# EAGLE design Robot_Psoc (EAGLE 7.5.0)
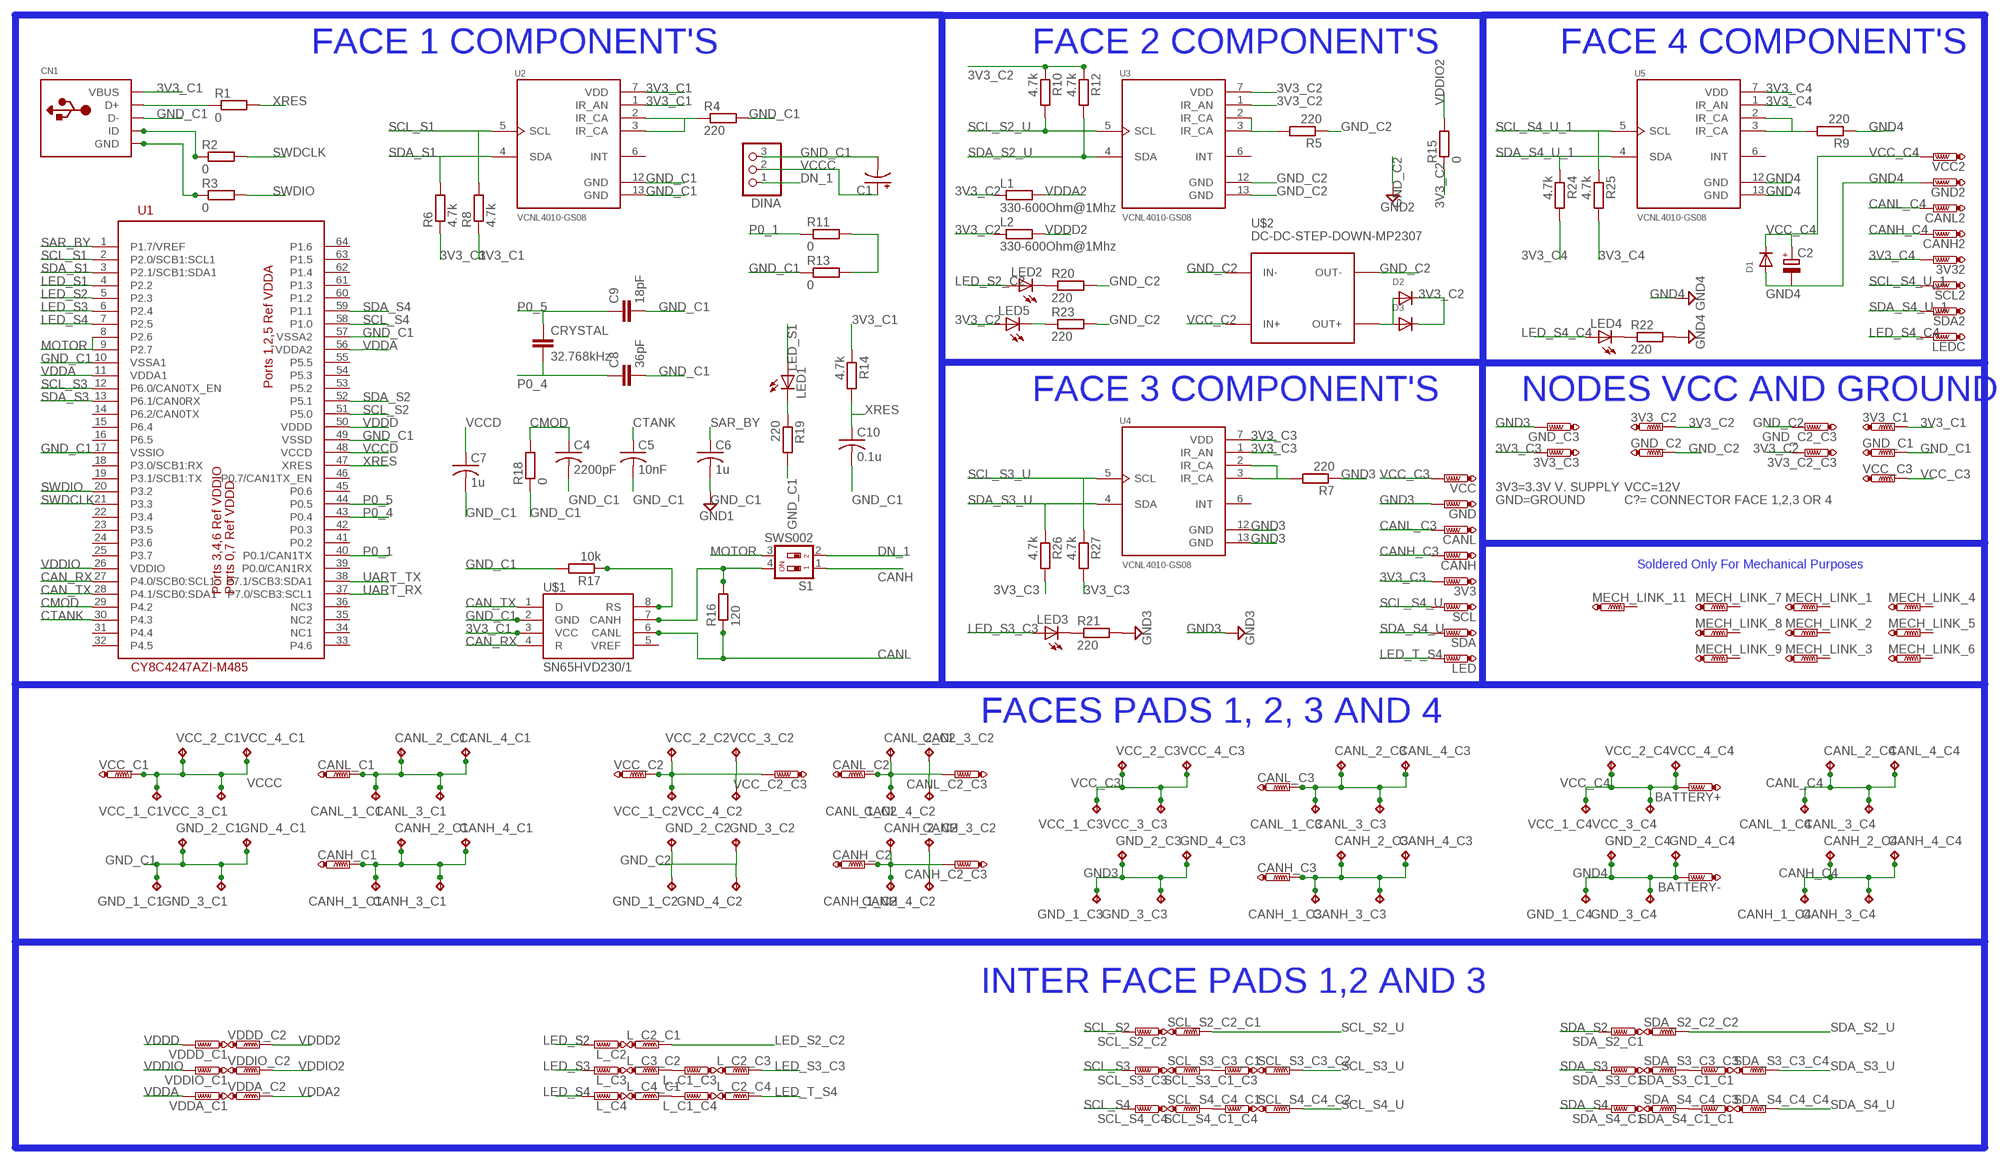
[diagram p0: schematic, sheet 1]

## Parts
3V3  PTR1TP11R  [TP11R]
3V3_C1  PTR1TP11R  [TP11R]
3V3_C2  PTR1TP11R  [TP11R]
3V3_C2_C3  PTR1TP11R  [TP11R]
3V3_C3  PTR1TP11R  [TP11R]
3V32  PTR1TP11R  [TP11R]
BATTERY+  PTR1TP11R  [TP11R]
BATTERY-  PTR1TP11R  [TP11R]
C1  CPOL-USUD-5X5,8  [UD-5X5,8_NICHICON]
C2  CPOL-EUUD-8X10  [UD-8X10_NICHICON]
C4  2200pF  C-USC0805  [C0805]
C5  10nF  C-USC0805  [C0805]
C6  1u  C-USC0805  [C0805]
C7  1u  C-USC0805  [C0805]
C8  36pF  C-EUC0805  [C0805]
C9  18pF  C-EUC0805  [C0805]
C10  0.1u  C-USC0805  [C0805]
CANH  PTR1TP11R  [TP11R]
CANH2  PTR1TP11R  [TP11R]
CANH_1_C1  TPB2,54  [B2,54]
CANH_1_C2  TPB2,54  [B2,54]
CANH_1_C3  TPB2,54  [B2,54]
CANH_1_C4  TPB2,54  [B2,54]
CANH_2_C1  TPB2,54  [B2,54]
CANH_2_C2  TPB2,54  [B2,54]
CANH_2_C3  TPB2,54  [B2,54]
CANH_2_C4  TPB2,54  [B2,54]
CANH_3_C1  TPB2,54  [B2,54]
CANH_3_C2  TPB2,54  [B2,54]
CANH_3_C3  TPB2,54  [B2,54]
CANH_3_C4  TPB2,54  [B2,54]
CANH_4_C1  TPB2,54  [B2,54]
CANH_4_C2  TPB2,54  [B2,54]
CANH_4_C3  TPB2,54  [B2,54]
CANH_4_C4  TPB2,54  [B2,54]
CANH_C1  PTR1TP11R  [TP11R]
CANH_C2  PTR1TP11R  [TP11R]
CANH_C2_C3  PTR1TP11R  [TP11R]
CANH_C3  PTR1TP11R  [TP11R]
CANL  PTR1TP11R  [TP11R]
CANL2  PTR1TP11R  [TP11R]
CANL_1_C1  TPB2,54  [B2,54]
CANL_1_C2  TPB2,54  [B2,54]
CANL_1_C3  TPB2,54  [B2,54]
CANL_1_C4  TPB2,54  [B2,54]
CANL_2_C1  TPB2,54  [B2,54]
CANL_2_C2  TPB2,54  [B2,54]
CANL_2_C3  TPB2,54  [B2,54]
CANL_2_C4  TPB2,54  [B2,54]
CANL_3_C1  TPB2,54  [B2,54]
CANL_3_C2  TPB2,54  [B2,54]
CANL_3_C3  TPB2,54  [B2,54]
CANL_3_C4  TPB2,54  [B2,54]
CANL_4_C1  TPB2,54  [B2,54]
CANL_4_C2  TPB2,54  [B2,54]
CANL_4_C3  TPB2,54  [B2,54]
CANL_4_C4  TPB2,54  [B2,54]
CANL_C1  PTR1TP11R  [TP11R]
CANL_C2  PTR1TP11R  [TP11R]
CANL_C2_C3  PTR1TP11R  [TP11R]
CANL_C3  PTR1TP11R  [TP11R]
CN1  USBMINIB  [USB-MINIB]
CRYSTAL  32.768kHz  C-EUC0603  [C0603]
D1  DIODESMA  [SMADIODE]
D2  DIODESOD-123  [SOD-123]
D3  DIODESOD-123  [SOD-123]
DINA  PINHD-1X3  [1X03]
GND  PTR1TP11R  [TP11R]
GND2  PTR1TP11R  [TP11R]
GND_1_C1  TPB2,54  [B2,54]
GND_1_C2  TPB2,54  [B2,54]
GND_1_C3  TPB2,54  [B2,54]
GND_1_C4  TPB2,54  [B2,54]
GND_2_C1  TPB2,54  [B2,54]
GND_2_C2  TPB2,54  [B2,54]
GND_2_C3  TPB2,54  [B2,54]
GND_2_C4  TPB2,54  [B2,54]
GND_3_C1  TPB2,54  [B2,54]
GND_3_C2  TPB2,54  [B2,54]
GND_3_C3  TPB2,54  [B2,54]
GND_3_C4  TPB2,54  [B2,54]
GND_4_C1  TPB2,54  [B2,54]
GND_4_C2  TPB2,54  [B2,54]
GND_4_C3  TPB2,54  [B2,54]
GND_4_C4  TPB2,54  [B2,54]
GND_C1  PTR1TP11R  [TP11R]
GND_C2  PTR1TP11R  [TP11R]
GND_C2_C3  PTR1TP11R  [TP11R]
GND_C3  PTR1TP11R  [TP11R]
L1  330-600Ohm@1Mhz  R-EU_R0805  [R0805]
L2  330-600Ohm@1Mhz  R-EU_R0805  [R0805]
L_C1_C3  PTR1TP11R  [TP11R]
L_C1_C4  PTR1TP11R  [TP11R]
L_C2  PTR1TP11R  [TP11R]
L_C2_C1  PTR1TP11R  [TP11R]
L_C2_C3  PTR1TP11R  [TP11R]
L_C2_C4  PTR1TP11R  [TP11R]
L_C3  PTR1TP11R  [TP11R]
L_C3_C2  PTR1TP11R  [TP11R]
L_C4  PTR1TP11R  [TP11R]
L_C4_C1  PTR1TP11R  [TP11R]
LED  PTR1TP11R  [TP11R]
LED1  LEDCHIPLED_0805  [CHIPLED_0805]
LED2  LEDCHIPLED_0805  [CHIPLED_0805]
LED3  LEDCHIPLED_0805  [CHIPLED_0805]
LED4  LEDCHIPLED_0805  [CHIPLED_0805]
LED5  LEDCHIPLED_0805  [CHIPLED_0805]
LEDC  PTR1TP11R  [TP11R]
MECH_LINK_1  PTR1TP11R  [TP11R]
MECH_LINK_2  PTR1TP11R  [TP11R]
MECH_LINK_3  PTR1TP11R  [TP11R]
MECH_LINK_4  PTR1TP11R  [TP11R]
MECH_LINK_5  PTR1TP11R  [TP11R]
MECH_LINK_6  PTR1TP11R  [TP11R]
MECH_LINK_7  PTR1TP11R  [TP11R]
MECH_LINK_8  PTR1TP11R  [TP11R]
MECH_LINK_9  PTR1TP11R  [TP11R]
MECH_LINK_11  PTR1TP11R  [TP11R]
R1  0  R-EU_R0805  [R0805]
R2  0  R-EU_R0805  [R0805]
R3  0  R-EU_R0805  [R0805]
R4  220  R-EU_R0805  [R0805]
R5  220  R-EU_R0805  [R0805]
R6  4.7k  R-EU_R0805  [R0805]
R7  220  R-EU_R0805  [R0805]
R8  4.7k  R-EU_R0805  [R0805]
R9  220  R-EU_R0805  [R0805]
R10  4.7k  R-EU_R0805  [R0805]
R11  0  R-EU_R0805  [R0805]
R12  4.7k  R-EU_R0805  [R0805]
R13  0  R-EU_R0805  [R0805]
R14  4.7k  R-EU_R0805  [R0805]
R15  0  R-EU_R0805  [R0805]
R16  120  R-EU_R0805  [R0805]
R17  10k  R-EU_R0805  [R0805]
R18  0  R-EU_R0805  [R0805]
R19  220  R-EU_R0805  [R0805]
R20  220  R-EU_R0805  [R0805]
R21  220  R-EU_R0805  [R0805]
R22  220  R-EU_R0805  [R0805]
R23  220  R-EU_R0805  [R0805]
R24  4.7k  R-EU_R0805  [R0805]
R25  4.7k  R-EU_R0805  [R0805]
R26  4.7k  R-EU_R0805  [R0805]
R27  4.7k  R-EU_R0805  [R0805]
S1  SWS002  [SMS-002]
SCL  PTR1TP11R  [TP11R]
SCL2  PTR1TP11R  [TP11R]
SCL_S2_C2  PTR1TP11R  [TP11R]
SCL_S2_C2_C1  PTR1TP11R  [TP11R]
SCL_S3_C1_C3  PTR1TP11R  [TP11R]
SCL_S3_C3  PTR1TP11R  [TP11R]
SCL_S3_C3_C1  PTR1TP11R  [TP11R]
SCL_S3_C3_C2  PTR1TP11R  [TP11R]
SCL_S4_C1_C4  PTR1TP11R  [TP11R]
SCL_S4_C4  PTR1TP11R  [TP11R]
SCL_S4_C4_C1  PTR1TP11R  [TP11R]
SCL_S4_C4_C2  PTR1TP11R  [TP11R]
SDA  PTR1TP11R  [TP11R]
SDA2  PTR1TP11R  [TP11R]
SDA_S2_C1  PTR1TP11R  [TP11R]
SDA_S2_C2_C2  PTR1TP11R  [TP11R]
SDA_S3_C1  PTR1TP11R  [TP11R]
SDA_S3_C1_C1  PTR1TP11R  [TP11R]
SDA_S3_C3_C3  PTR1TP11R  [TP11R]
SDA_S3_C3_C4  PTR1TP11R  [TP11R]
SDA_S4_C1  PTR1TP11R  [TP11R]
SDA_S4_C1_C1  PTR1TP11R  [TP11R]
SDA_S4_C4_C3  PTR1TP11R  [TP11R]
SDA_S4_C4_C4  PTR1TP11R  [TP11R]
U1  CY8C4247AZI-M485  [TQFP64-10X10]
U2  VCNL4010-GS08  [XDCR_VCNL4010-GS08]
U3  VCNL4010-GS08  [XDCR_VCNL4010-GS08]
U4  VCNL4010-GS08  [XDCR_VCNL4010-GS08]
U5  VCNL4010-GS08  [XDCR_VCNL4010-GS08]
U$1  SN65HVD230/1  [SO8]
U$2  DC-DC-STEP-DOWN-MP2307  [DC-DC-STEP-DOWN-MP2307]
VCC  PTR1TP11R  [TP11R]
VCC2  PTR1TP11R  [TP11R]
VCC_1_C1  TPB2,54  [B2,54]
VCC_1_C2  TPB2,54  [B2,54]
VCC_1_C3  TPB2,54  [B2,54]
VCC_1_C4  TPB2,54  [B2,54]
VCC_2_C1  TPB2,54  [B2,54]
VCC_2_C2  TPB2,54  [B2,54]
VCC_2_C3  TPB2,54  [B2,54]
VCC_2_C4  TPB2,54  [B2,54]
VCC_3_C1  TPB2,54  [B2,54]
VCC_3_C2  TPB2,54  [B2,54]
VCC_3_C3  TPB2,54  [B2,54]
VCC_3_C4  TPB2,54  [B2,54]
VCC_4_C1  TPB2,54  [B2,54]
VCC_4_C2  TPB2,54  [B2,54]
VCC_4_C3  TPB2,54  [B2,54]
VCC_4_C4  TPB2,54  [B2,54]
VCC_C1  PTR1TP11R  [TP11R]
VCC_C2  PTR1TP11R  [TP11R]
VCC_C2_C3  PTR1TP11R  [TP11R]
VCC_C3  PTR1TP11R  [TP11R]
VDDA_C1  PTR1TP11R  [TP11R]
VDDA_C2  PTR1TP11R  [TP11R]
VDDD_C1  PTR1TP11R  [TP11R]
VDDD_C2  PTR1TP11R  [TP11R]
VDDIO_C1  PTR1TP11R  [TP11R]
VDDIO_C2  PTR1TP11R  [TP11R]

## Nets
3V3_C1: 3V3_C1.TP CN1.VBUS R6.1 R8.1 R14.1 U2.1(IR_AN) U2.7(VDD) U$1.3(VCC)
3V3_C2: 3V3_C2.TP 3V3_C2_C3.TP D2.C D3.C L1.1 L2.1 LED5.A R10.1 R12.1 R15.1 U3.1(IR_AN) U3.7(VDD)
3V3_C3: 3V3.TP 3V3_C3.TP R26.2 R27.2 U4.1(IR_AN) U4.7(VDD)
3V3_C4: 3V32.TP R24.2 R25.2 U5.1(IR_AN) U5.7(VDD)
CAN_RX: U1.27(P4.0/SCB0:SCL1) U$1.4(R)
CAN_TX: U1.28(P4.1/SCB0:SDA1) U$1.1(D)
CANH: CANH_1_C1.TP CANH_2_C1.TP CANH_3_C1.TP CANH_4_C1.TP CANH_C1.TP S1.1
CANH_C3: CANH.TP CANH_1_C3.TP CANH_2_C3.TP CANH_3_C3.TP CANH_4_C3.TP CANH_C3.TP
CANH_C4: CANH2.TP CANH_1_C4.TP CANH_2_C4.TP CANH_3_C4.TP CANH_4_C4.TP
CANL: CANL_1_C1.TP CANL_2_C1.TP CANL_3_C1.TP CANL_4_C1.TP CANL_C1.TP R16.1 U$1.6(CANL)
CANL_C3: CANL.TP CANL_1_C3.TP CANL_2_C3.TP CANL_3_C3.TP CANL_4_C3.TP CANL_C3.TP
CANL_C4: CANL2.TP CANL_1_C4.TP CANL_2_C4.TP CANL_3_C4.TP CANL_4_C4.TP
CMOD: C4.1 R18.2 U1.29(P4.2)
CTANK: C5.1 U1.30(P4.3)
DN_1: DINA.1 S1.2
GND3: GND.TP GND_1_C3.TP GND_2_C3.TP GND_3_C3.TP GND_4_C3.TP GND_C3.TP R7.1 R21.2 U4.12(GND) U4.13(GND)
GND4: BATTERY-.TP C2.- D1.A GND2.TP GND_1_C4.TP GND_2_C4.TP GND_3_C4.TP GND_4_C4.TP R9.1 R22.2 U5.12(GND) U5.13(GND)
GND_C1: C1.- C4.2 C5.2 C6.2 C7.2 C8.2 C9.2 C10.2 CN1.D- DINA.3 GND_1_C1.TP GND_2_C1.TP GND_3_C1.TP GND_4_C1.TP GND_C1.TP R4.2 R13.1 R17.2 R18.1 R19.2 U1.10(VSSA1) U1.17(VSSIO) U1.49(VSSD) U1.57(VSSA2) U2.12(GND) U2.13(GND) U$1.2(GND) ; supply symbol labelled GND1
GND_C2: GND_1_C2.TP GND_2_C2.TP GND_3_C2.TP GND_4_C2.TP GND_C2.TP GND_C2_C3.TP R5.1 R20.2 R23.2 U3.12(GND) U3.13(GND) U$2.IN- U$2.OUT- ; supply symbol labelled GND2
LED_S1: LED1.A U1.4(P2.2)
LED_S2: L_C2.TP U1.5(P2.3)
LED_S2_C2: L_C2_C1.TP LED2.A
LED_S3: L_C3.TP U1.6(P2.4)
LED_S3_C3: L_C2_C3.TP LED3.A
LED_S4: L_C4.TP U1.7(P2.5)
LED_S4_C4: LED4.A LEDC.TP
LED_T_S4: L_C2_C4.TP LED.TP
MOTOR: S1.3 U1.8(P2.6) U1.9(P2.7)
N$1: CN1.D+ R1.1
N$2: CN1.ID R2.1
N$3: CN1.GND R3.1
N$4: R11.2 R13.2
N$5: R16.2 S1.4 U$1.7(CANH)
N$7: CANH_1_C2.TP CANH_2_C2.TP CANH_3_C2.TP CANH_4_C2.TP CANH_C2.TP CANH_C2_C3.TP
N$8: R7.2 U4.2(IR_CA) U4.3(IR_CA)
N$9: R17.1 U$1.8(RS)
N$10: SDA_S3_C1_C1.TP SDA_S3_C3_C3.TP
N$14: LED1.C R19.1
N$15: LED2.C R20.1
N$16: LED3.C R21.1
N$17: LED4.C R22.1
N$18: LED5.C R23.1
N$20: L_C1_C4.TP L_C4_C1.TP
N$21: R4.1 U2.2(IR_CA) U2.3(IR_CA)
N$22: L_C1_C3.TP L_C3_C2.TP
N$24: D2.A D3.A U$2.OUT+
N$26: SCL_S3_C1_C3.TP SCL_S3_C3_C1.TP
N$27: SCL_S4_C1_C4.TP SCL_S4_C4_C1.TP
N$32: CANL_1_C2.TP CANL_2_C2.TP CANL_3_C2.TP CANL_4_C2.TP CANL_C2.TP CANL_C2_C3.TP
N$43: R5.2 U3.2(IR_CA) U3.3(IR_CA)
N$44: SDA_S4_C1_C1.TP SDA_S4_C4_C3.TP
N$46: R9.2 U5.2(IR_CA) U5.3(IR_CA)
P0_1: R11.1 U1.40(P0.1/CAN1TX)
P0_4: C8.1 CRYSTAL.2 U1.43(P0.4)
P0_5: C9.1 CRYSTAL.1 U1.44(P0.5)
SAR_BY: C6.1 U1.1(P1.7/VREF)
SCL_S1: R8.2 U1.2(P2.0/SCB1:SCL1) U2.5(SCL)
SCL_S2: SCL_S2_C2.TP U1.51(P5.0)
SCL_S2_U: R10.2 SCL_S2_C2_C1.TP U3.5(SCL)
SCL_S3: SCL_S3_C3.TP U1.12(P6.0/CAN0TX_EN)
SCL_S3_U: R27.1 SCL_S3_C3_C2.TP U4.5(SCL)
SCL_S4: SCL_S4_C4.TP U1.58(P1.0)
SCL_S4_U: SCL.TP SCL_S4_C4_C2.TP
SCL_S4_U_1: R25.1 SCL2.TP U5.5(SCL)
SDA_S1: R6.2 U1.3(P2.1/SCB1:SDA1) U2.4(SDA)
SDA_S2: SDA_S2_C1.TP U1.52(P5.1)
SDA_S2_U: R12.2 SDA_S2_C2_C2.TP U3.4(SDA)
SDA_S3: SDA_S3_C1.TP U1.13(P6.1/CAN0RX)
SDA_S3_U: R26.1 SDA_S3_C3_C4.TP U4.4(SDA)
SDA_S4: SDA_S4_C1.TP U1.59(P1.1)
SDA_S4_U: SDA.TP SDA_S4_C4_C4.TP
SDA_S4_U_1: R24.1 SDA2.TP U5.4(SDA)
SWDCLK: R2.2 U1.21(P3.3)
SWDIO: R3.2 U1.20(P3.2)
UART_RX: U1.37(P7.0/SCB3:SCL1)
UART_TX: U1.38(P7.1/SCB3:SDA1)
VCC_C2: U$2.IN+ VCC_1_C2.TP VCC_2_C2.TP VCC_3_C2.TP VCC_4_C2.TP VCC_C2.TP VCC_C2_C3.TP
VCC_C3: VCC.TP VCC_1_C3.TP VCC_2_C3.TP VCC_3_C3.TP VCC_4_C3.TP VCC_C3.TP
VCC_C4: BATTERY+.TP C2.+ D1.C VCC2.TP VCC_1_C4.TP VCC_2_C4.TP VCC_3_C4.TP VCC_4_C4.TP
VCCC: C1.+ DINA.2 VCC_1_C1.TP VCC_2_C1.TP VCC_3_C1.TP VCC_4_C1.TP VCC_C1.TP
VCCD: C7.1 U1.48(VCCD)
VDDA: U1.11(VDDA1) U1.56(VDDA2) VDDA_C1.TP
VDDA2: L1.2 VDDA_C2.TP
VDDD: U1.50(VDDD) VDDD_C1.TP
VDDD2: L2.2 VDDD_C2.TP
VDDIO: U1.26(VDDIO) VDDIO_C1.TP
VDDIO2: R15.2 VDDIO_C2.TP
XRES: C10.1 R1.2 R14.2 U1.47(XRES)
Unconnected: MECH_LINK_1.TP MECH_LINK_2.TP MECH_LINK_3.TP MECH_LINK_4.TP MECH_LINK_5.TP MECH_LINK_6.TP MECH_LINK_7.TP MECH_LINK_8.TP MECH_LINK_9.TP MECH_LINK_11.TP U1.14(P6.2/CAN0TX) U1.15(P6.4) U1.16(P6.5) U1.18(P3.0/SCB1:RX) U1.19(P3.1/SCB1:TX) U1.22(P3.4) U1.23(P3.5) U1.24(P3.6) U1.25(P3.7) U1.31(P4.4) U1.32(P4.5) U1.33(P4.6) U1.34(NC1) U1.35(NC2) U1.36(NC3) U1.39(P0.0/CAN1RX) U1.41(P0.2) U1.42(P0.3) U1.45(P0.6) U1.46(P0.7/CAN1TX_EN) U1.53(P5.2) U1.54(P5.3) U1.55(P5.5) U1.60(P1.2) U1.61(P1.3) U1.62(P1.4) U1.63(P1.5) U1.64(P1.6) U2.6(INT) U3.6(INT) U4.6(INT) U5.6(INT) U$1.5(VREF)

## Notes on the sheet
- FACE 1 COMPONENT'S | FACE 2 COMPONENT'S | FACE 4 COMPONENT'S
- FACE 3 COMPONENT'S | NODES VCC AND GROUND
- 3V3=3.3V V. SUPPLY | VCC=12V
- GND=GROUND | C?= CONNECTOR FACE 1,2,3 OR 4
- Soldered Only For Mechanical Purposes
- FACES PADS 1, 2, 3 AND 4
- INTER FACE PADS 1,2 AND 3

## Library data of the parts
3V3 3V3_C1 3V3_C2 3V3_C2_C3 3V3_C3 3V32 BATTERY+ BATTERY- CANH CANH2 CANH_C1 CANH_C2 CANH_C2_C3 CANH_C3 CANL CANL2 CANL_C1 CANL_C2 CANL_C2_C3 CANL_C3 GND GND2 GND_C1 GND_C2 GND_C2_C3 GND_C3 L_C1_C3 L_C1_C4 L_C2 L_C2_C1 L_C2_C3 L_C2_C4 L_C3 L_C3_C2 L_C4 L_C4_C1 LED LEDC MECH_LINK_1-MECH_LINK_9 MECH_LINK_11 SCL SCL2 SCL_S2_C2 SCL_S2_C2_C1 SCL_S3_C1_C3 SCL_S3_C3 SCL_S3_C3_C1 SCL_S3_C3_C2 SCL_S4_C1_C4 SCL_S4_C4 SCL_S4_C4_C1 SCL_S4_C4_C2 SDA SDA2 SDA_S2_C1 SDA_S2_C2_C2 SDA_S3_C1 SDA_S3_C1_C1 SDA_S3_C3_C3 SDA_S3_C3_C4 SDA_S4_C1 SDA_S4_C1_C1 SDA_S4_C4_C3 SDA_S4_C4_C4 VCC VCC2 VCC_C1 VCC_C2 VCC_C2_C3 VCC_C3 VDDA_C1 VDDA_C2 VDDD_C1 VDDD_C2 VDDIO_C1 VDDIO_C2 = testpad:PTR1: TEST PIN
C1 = rcl:CPOL-US: POLARIZED CAPACITOR, American symbol
C2 = rcl:CPOL-EU: POLARIZED CAPACITOR, European symbol
C4-C7 C10 = rcl:C-US: CAPACITOR, American symbol
C8 C9 CRYSTAL = rcl:C-EU: CAPACITOR, European symbol
CANH_1_C1-CANH_1_C4 CANH_2_C1-CANH_2_C4 CANH_3_C1-CANH_3_C4 CANH_4_C1-CANH_4_C4 CANL_1_C1-CANL_1_C4 CANL_2_C1-CANL_2_C4 CANL_3_C1-CANL_3_C4 CANL_4_C1-CANL_4_C4 GND_1_C1-GND_1_C4 GND_2_C1-GND_2_C4 GND_3_C1-GND_3_C4 GND_4_C1-GND_4_C4 VCC_1_C1-VCC_1_C4 VCC_2_C1-VCC_2_C4 VCC_3_C1-VCC_3_C4 VCC_4_C1-VCC_4_C4 = testpad:TP: Test pad
CN1 = adafruit:USB: USB Connectors USBMINIB - Surface Mount Female Mini-B USB Connector 4UConnector: 06564 By microbuilder.eu Thru-hole RA Female Mini-B USB Connector 4UConnector: 18732 By ladyada.net
D1-D3 = adafruit:DIODE: Diode SMADIODE - SMA Surface Mount Package 20V 1A Schottky Diode Digikey: 641-1014-6-ND DO-1N4148 - Through Hole Small Current Diode SOD-123 20V 1 A (.5mV Vf) Schottky Diode - Digikey: MBRX120TPMSCT-ND SOD-323 10V 570mA (.38mV Vf, 3ns) Schottky Diode - Digikey: ZLLS410CT-ND SOD-523 30V 30mA Schottky Diode (RB751S-40TE61) - Digikey: RB751S-40TE61CT-ND SOT23-R/W - SOT23 Package (R = Solder Paste/Reflow Ovens, W = Hand-Soldering) BAT54Film 40V 300mA - Digikey: 497-7162-1-ND
DINA = pinhead:PINHD-1X3: PIN HEADER
L1 L2 R1-R27 = rcl:R-EU_: RESISTOR, European symbol
LED1-LED5 = adafruit:LED: LED OSRAM: - CHIPLED LG R971, LG N971, LY N971, LG Q971, LY Q971, LO R971, LY R971 LH N974, LH R974 LS Q976, LO Q976, LY Q976 LO Q996 - Hyper CHIPLED LW Q18S LB Q993, LB Q99A, LB R99A - SideLED LS A670, LO A670, LY A670, LG A670, LP A670 LB A673, LV A673, LT A673, LW A673 LH A674 LY A675 LS A676, LA A676, LO A676, LY A676, LW A676 LS A679, LY A679, LG A679 - Hyper Micro SIDELED® LS Y876, LA Y876, LO Y876, LY Y876 LT Y87S - SmartLED LW L88C, LW L88S LB L89C, LB L89S, LG L890 LS L89K, LO L89K, LY L89K LS L896, LA L896, LO L896, LY L896 - TOPLED LS T670, LO T670, LY T670, LG T670, LP T670 LSG T670, LSP T670, LSY T670, LOP T670, LYG T670 LG T671, LOG T671, LSG T671 LB T673, LV T673, LT T673, LW T673 LH T674 LS T676, LA T676, LO T676, LY T676, LB T676, LH T676, LSB T676, LW T676 LB T67C, LV T67C, LT T67C, LS T67K, LO T67K, LY T67K, LW E67C LS E67B, LA E67B, LO E67B, LY E67B, LB E67C, LV E67C, LT E67C LW T67C LS T679, LY T679, LG T679 LS T770, LO T770, LY T770, LG T770, LP T770 LB T773, LV T773, LT T773, LW T773 LH T774 LS E675, LA E675, LY E675, LS T675 LS T776, LA T776, LO T776, LY T776, LB T776 LHGB T686 LT T68C, LB T68C - Hyper Mini TOPLED® LB M676 - Mini TOPLED Santana® LG M470 LS M47K, LO M47K, LY M47K Source: http://www.osram.convergy.de/
S1 = smd-special:SWS002: SMD Dip Switch 2 pol.
U1 = CypressPSoC:CY8C4247AZI-M485
U2-U5 = VCNL4010-GS08:VCNL4010-GS08
U$1 = texas_instruments:SN65HVD230/1
U$2 = diy-modules:DC-DC-STEP-DOWN-MP2307: DC/DC Step-Down Regulator based on MP2307DN chip MP2307 datasheet available here: https://cdn-shop.adafruit.com/datasheets/MP2307_r1.9.pdf Click here to find device on ebay.com <http://www.ebay.com/sch/dc+dc+3a+mini+converter>

## Board
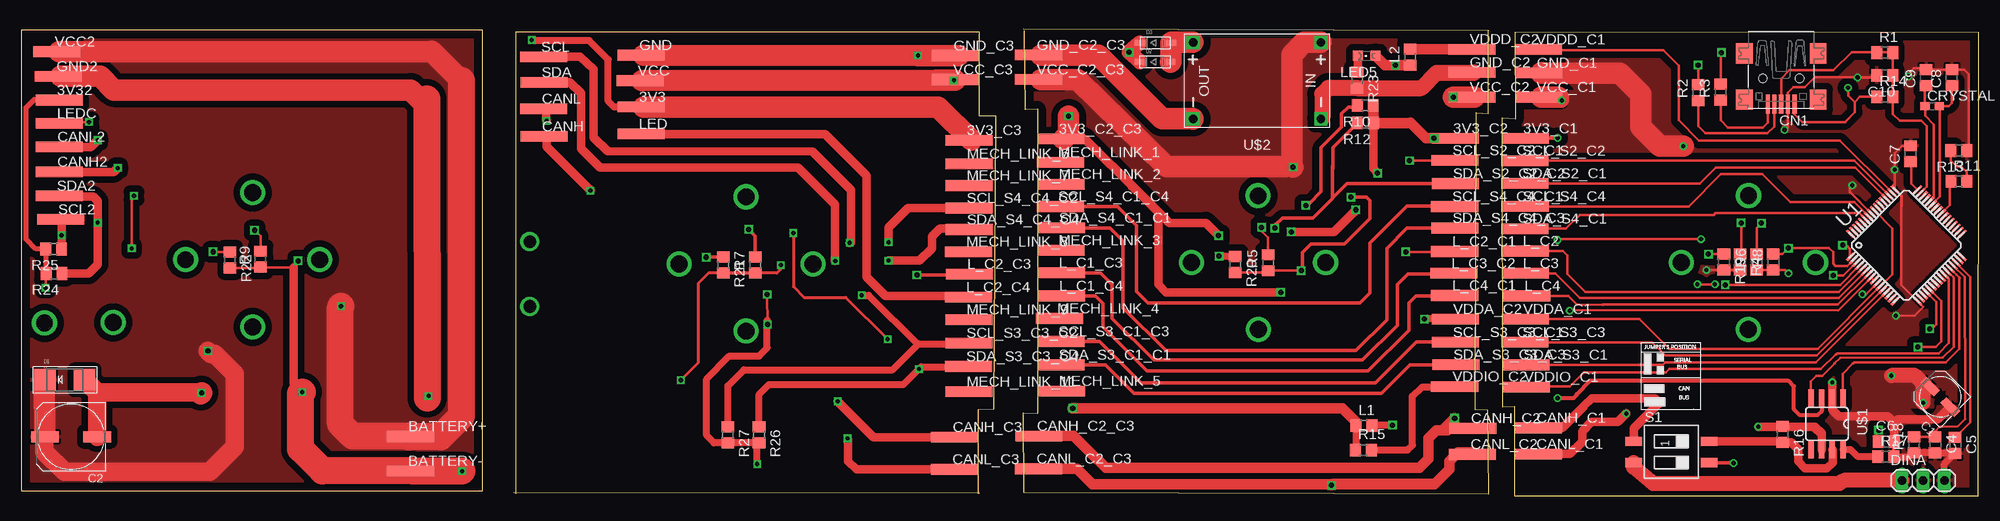
[diagram p1: board, top side]
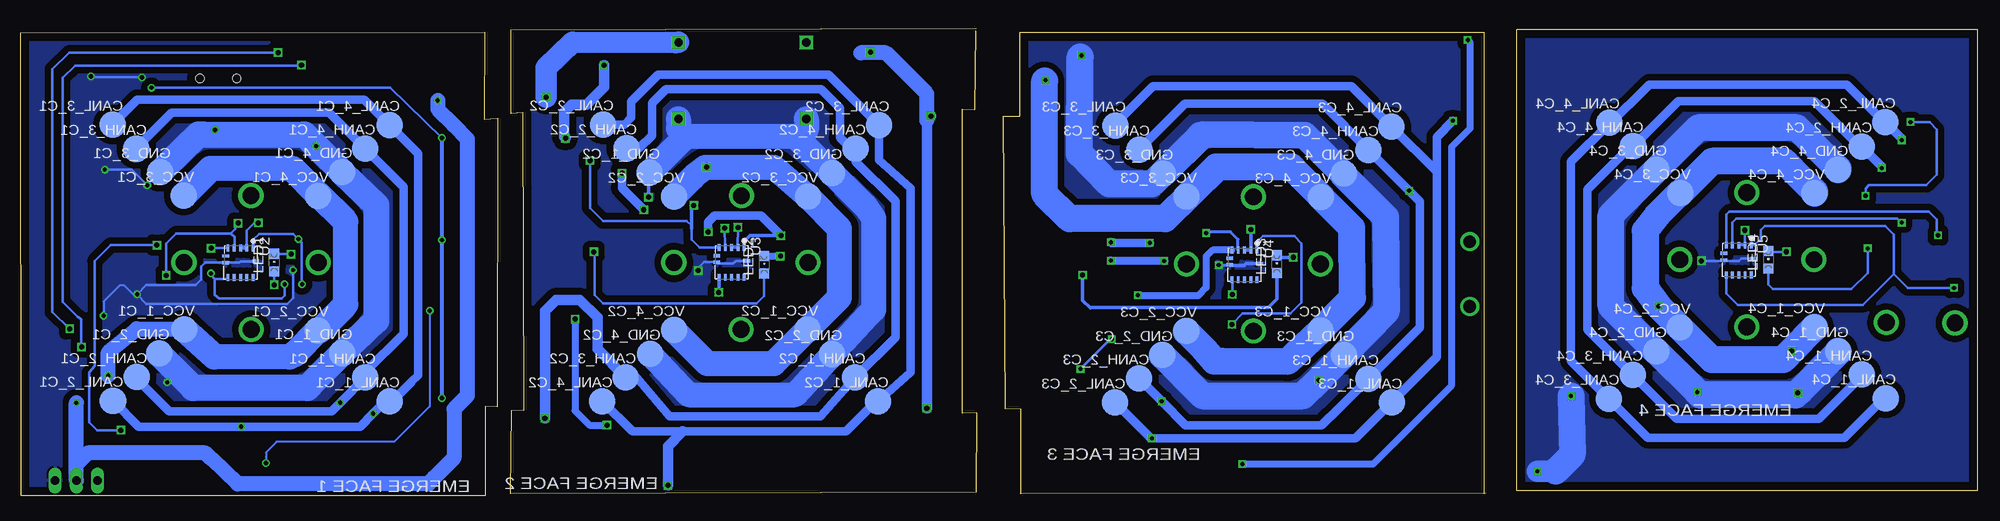
[diagram p2: board, bottom side, seen from below]

Size 233.41 x 55.75 mm. Coordinates in mm from the lower left corner, seen from the top.
Outline: 119.48,55.75 174.99,55.59
Outline: 114.12,0.25 114.14,10.35 115.97,10.37 116.21,45.31 114.24,45.31 114.28,55.35 58.9,55.37 58.93,0.28
Outline: 174.92,55.5 174.92,45.64 173.52,45.74 173.41,10.25 174.91,10.22 175.02,0.23 119.52,0.44 119.41,9.91 121.15,9.83 121.15,46.16 119.67,46.11 119.57,55.55
Outline: 114.28,0.31 58.7,0.36
Outline: 178.16,44.97 176.57,45.07 176.62,10.62 178.06,10.67 178.06,0 233.36,0.04 233.41,55.29 178.09,55.35 178.16,44.97
Outline: 0,0.62 55,0.62 55,55.62 0,55.62 0,0.62
Copper layers (1*16): Top 0.035mm / dielectric 1.5mm / Bottom 0.035mm
Design rules "default": minimum track width 10mil, minimum drill 24mil, track to track 8mil, track to pad 8mil, pad to pad 8mil, via to via 8mil, smd to smd 8mil, copper to edge 40mil, drill to drill 8mil, minimum pad ring 10mil, minimum via ring 8mil, stop-mask expansion 4mil, vias tented up to drill 0mil, thermal gap 10mil

### Footprints (pad centres in the part's own frame; a part is rotated, then mirrored left to right if it is on the bottom)
TP11R = smd 0.635 x 1.27: P$1 0.381,0; P$2 1.016,0; P$3 -0.254,0; P$4 -0.889,0; P$5 -1.524,0; P$6 1.613,0; P$7 2.21,0; P$8 -2.146,0; P$9 -2.769,0 | smd 1.1 x 1.1: TP 0,0
UD-5X5,8_NICHICON = smd 2.3 x 1: + 1.725,0; - -1.7,0
UD-8X10_NICHICON = smd 3.3 x 1.3: + 3.125,0; - -3.125,0
C0805 = smd 1.3 x 1.5: 1 -0.95,0; 2 0.95,0
B2,54 = smd 3.175 x 3.175 bottom: P$1 0,0 | smd 2.54 x 2.54 bottom: TP 0,0
USB-MINIB = smd 0.5 x 2.308: D+ 0,4.064; D- -0.8,4.064; GND 1.6,4.064; ID 0.8,4.064; VBUS -1.6,4.064 | smd 2 x 2.4: GND1 -4.4,-2; GND2 -4.4,3.5; GND3 4.4,3.5; GND4 4.4,-2 | hole 1: -2.2,1; 2.2,1
C0603 = smd 1.1 x 1: 1 -0.85,0; 2 0.85,0
SMADIODE = smd 2.54 x 2.54: A 2.349,0; C -2.349,0
SOD-123 = smd 1.2 x 0.7: A 1.85,0; C -1.85,0
1X03 = drill 1.016 long: 1 -2.54,0; 2 0,0; 3 2.54,0
R0805 = smd 1.3 x 1.5: 1 -0.95,0; 2 0.95,0
CHIPLED_0805 = smd 1.2 x 1.2: A 0,-1.05; C 0,1.05
SMS-002 = smd 1.092 x 2.007: 1 -1.27,-4.496; 2 1.27,-4.496; 3 1.27,4.496; 4 -1.27,4.496
TQFP64-10X10 = smd 1.2 x 0.3: 1 -5.7,3.75; 2 -5.7,3.25; 3 -5.7,2.75; 4 -5.7,2.25; 5 -5.7,1.75; 6 -5.7,1.25; 7 -5.7,0.75; 8 -5.7,0.25; 9 -5.7,-0.25; 10 -5.7,-0.75; 11 -5.7,-1.25; 12 -5.7,-1.75; 13 -5.7,-2.25; 14 -5.7,-2.75; 15 -5.7,-3.25; 16 -5.7,-3.75; 33 5.7,-3.75; 34 5.7,-3.25; 35 5.7,-2.75; 36 5.7,-2.25; 37 5.7,-1.75; 38 5.7,-1.25; 39 5.7,-0.75; 40 5.7,-0.25; 41 5.7,0.25; 42 5.7,0.75; 43 5.7,1.25; 44 5.7,1.75; 45 5.7,2.25; 46 5.7,2.75; 47 5.7,3.25; 48 5.7,3.75 | smd 0.3 x 1.2: 17 -3.75,-5.7; 18 -3.25,-5.7; 19 -2.75,-5.7; 20 -2.25,-5.7; 21 -1.75,-5.7; 22 -1.25,-5.7; 23 -0.75,-5.7; 24 -0.25,-5.7; 25 0.25,-5.7; 26 0.75,-5.7; 27 1.25,-5.7; 28 1.75,-5.7; 29 2.25,-5.7; 30 2.75,-5.7; 31 3.25,-5.7; 32 3.75,-5.7; 49 3.75,5.7; 50 3.25,5.7; 51 2.75,5.7; 52 2.25,5.7; 53 1.75,5.7; 54 1.25,5.7; 55 0.75,5.7; 56 0.25,5.7; 57 -0.25,5.7; 58 -0.75,5.7; 59 -1.25,5.7; 60 -1.75,5.7; 61 -2.25,5.7; 62 -2.75,5.7; 63 -3.25,5.7; 64 -3.75,5.7
XDCR_VCNL4010-GS08 = smd 0.805 x 0.35: 1 -1.772,1.5; 2 -1.772,0.75; 3 -1.772,0; 4 -1.772,-0.75; 5 -1.772,-1.5; 7 1.772,-1.5; 8 1.772,-0.75; 9 1.772,0; 10 1.772,0.75; 11 1.772,1.5 | smd 0.4 x 0.805: 6 -0.8,-1.772; 12 -0.175,1.772; 13 0,-1.772
SO8 = smd 0.66 x 2.032: 1 -1.905,-3.073; 2 -0.635,-3.073; 3 0.635,-3.073; 4 1.905,-3.073; 5 1.905,3.073; 6 0.635,3.073; 7 -0.635,3.073; 8 -1.905,3.073
DC-DC-STEP-DOWN-MP2307 = drill 1 pad 1.6 square: IN+ -7.62,-4.572; IN- -7.62,4.572; OUT+ 7.62,-4.572; OUT- 7.62,4.572

### Placement (x,y rotation side)
3V3  74.19,46.43 0 top
3V3_C1  179.63,42.67 0 top
3V3_C2  171.28,42.67 0 top
3V3_C2_C3  124.26,42.61 0 top
3V3_C3  113.28,42.46 0 top
3V32  4.75,47.24 0 top
BATTERY+  46.68,7.11 0 top
BATTERY-  46.67,2.98 0 top
C1  228.83,11.83 135 top
C2  5.9,7.06 180 top
C4  228.23,6.09 270 top
C5  230.61,6.04 270 top
C6  222.38,6.5 0 top
C7  225.31,40.84 90 top
C8  230.23,49.9 90 top
C9  227.16,49.9 90 top
C10  222.21,50.18 180 top
CANH  62.59,42.9 0 top
CANH2  4.78,38.68 0 top
CANH_1_C1  192.34,14.13 0 top
CANH_1_C2  133.91,14.16 0 top
CANH_1_C3  72.7,13.95 0 top
CANH_1_C4  13.85,14.49 0 top
CANH_2_C1  219.59,14.18 0 top
CANH_2_C2  161.18,41.49 0 top
CANH_2_C3  100.07,14.02 0 top
CANH_2_C4  13.85,41.71 0 top
CANH_3_C1  219.65,41.43 0 top
CANH_3_C2  161.27,14.16 0 top
CANH_3_C3  100,41.33 0 top
CANH_3_C4  41.18,14.46 0 top
CANH_4_C1  192.38,41.47 0 top
CANH_4_C2  133.86,41.46 0 top
CANH_4_C3  72.7,41.28 0 top
CANH_4_C4  41.13,41.75 0 top
CANH_C1  181.19,8.12 0 top
CANH_C2  173.39,8.07 0 top
CANH_C2_C3  121.62,7.16 0 top
CANH_C3  111.57,7.02 0 top
CANL  62.56,46.21 0 top
CANL2  4.79,41.66 0 top
CANL_1_C1  189.46,11.29 0 top
CANL_1_C2  131.16,11.3 0 top
CANL_1_C3  69.9,11.15 0 top
CANL_1_C4  11.01,11.65 0 top
CANL_2_C1  222.43,11.36 0 top
CANL_2_C2  163.95,44.34 0 top
CANL_2_C3  102.93,11.15 0 top
CANL_2_C4  11.05,44.62 0 top
CANL_3_C1  222.48,44.3 0 top
CANL_3_C2  131.06,44.24 0 top
CANL_3_C3  102.87,44.2 0 top
CANL_3_C4  44,11.59 0 top
CANL_4_C1  189.45,44.28 0 top
CANL_4_C2  164.08,11.3 0 top
CANL_4_C3  69.93,44.1 0 top
CANL_4_C4  43.96,44.58 0 top
CANL_C1  181.19,5 0 top
CANL_C2  173.34,4.97 0 top
CANL_C2_C3  121.57,3.24 0 top
CANL_C3  111.53,3.17 0 top
CN1  209.86,50.82 180 top
CRYSTAL  227.87,46.53 0 top
D1  5.15,13.87 0 top
D2  135.18,51.79 0 top
D3  135.21,54.07 0 top
DINA  226.8,1.85 0 top
GND  74.19,52.6 0 top
GND2  4.67,50.08 0 top
GND_1_C1  195.11,17.04 0 top
GND_1_C2  158.43,38.58 0 top
GND_1_C3  75.62,16.82 0 top
GND_1_C4  16.67,17.28 0 top
GND_2_C1  216.93,17.04 0 top
GND_2_C2  136.69,16.92 0 top
GND_2_C3  97.27,16.82 0 top
GND_2_C4  38.36,17.28 0 top
GND_3_C1  216.78,38.66 0 top
GND_3_C2  136.7,38.55 0 top
GND_3_C3  97.21,38.47 0 top
GND_3_C4  38.33,38.96 0 top
GND_4_C1  195.11,38.67 0 top
GND_4_C2  158.35,16.97 0 top
GND_4_C3  75.62,38.47 0 top
GND_4_C4  16.7,38.92 0 top
GND_C1  181.24,50.49 0 top
GND_C2  173.24,50.54 0 top
GND_C2_C3  121.6,52.62 0 top
GND_C3  111.67,52.54 0 top
L1  160.1,8.38 0 top
L2  165.62,52.37 90 top
L_C1_C3  124.29,26.64 0 top
L_C1_C4  124.31,23.87 0 top
L_C2  179.61,29.23 0 top
L_C2_C1  171.2,29.18 0 top
L_C2_C3  113.36,26.48 0 top
L_C2_C4  113.23,23.71 0 top
L_C3  179.63,26.56 0 top
L_C3_C2  171.1,26.56 0 top
L_C4  179.81,23.87 0 top
L_C4_C1  171.2,23.92 0 top
LED  74.19,43.2 0 top
LED1  203.21,27.86 0 bottom
LED2  144.76,27.6 0 bottom
LED3  83.62,27.67 0 bottom
LED4  24.99,28.18 0 bottom
LED5  160.43,52.52 90 top
LEDC  4.79,44.46 0 top
MECH_LINK_1  124.19,39.82 0 top
MECH_LINK_2  124.26,37.2 0 top
MECH_LINK_3  124.24,29.31 0 top
MECH_LINK_4  124.09,21.18 0 top
MECH_LINK_5  124.29,12.52 0 top
MECH_LINK_6  113.31,39.64 0 top
MECH_LINK_7  113.28,37.05 0 top
MECH_LINK_8  113.23,29.15 0 top
MECH_LINK_9  113.26,21.05 0 top
MECH_LINK_11  113.26,12.43 0 top
R1  222.21,52.9 0 top
R2  199.98,48.15 90 top
R3  202.65,48.18 90 top
R4  204.96,27.91 270 top
R5  148.67,27.83 90 top
R6  206.94,27.91 90 top
R7  87.5,27.57 90 top
R8  208.92,27.91 90 top
R9  28.5,28.25 90 top
R10  160.25,46.6 180 top
R11  231.07,37.53 0 top
R12  160.28,44.52 180 top
R13  231.05,41.22 180 top
R14  222.23,47.64 0 top
R15  160.05,5.49 0 top
R16  210.05,7.35 270 top
R17  222.36,4.69 0 top
R18  225.71,6.11 90 top
R19  203.03,27.91 270 top
R20  144.76,27.6 270 top
R21  83.69,27.55 270 top
R22  24.86,28.18 270 top
R23  159.29,49.64 270 top
R24  3.87,26.55 180 top
R25  3.81,29.47 180 top
R26  87.96,7.28 270 top
R27  84.24,7.28 270 top
S1  196.77,5.25 270 top
SCL  62.53,52.4 0 top
SCL2  4.93,33 0 top
SCL_S2_C2  179.56,40 0 top
SCL_S2_C2_C1  171.23,40.05 0 top
SCL_S3_C1_C3  124.24,18.43 0 top
SCL_S3_C3  179.58,18.33 0 top
SCL_S3_C3_C1  171.28,18.33 0 top
SCL_S3_C3_C2  113.26,18.25 0 top
SCL_S4_C1_C4  124.19,34.54 0 top
SCL_S4_C4  179.61,34.56 0 top
SCL_S4_C4_C1  171.2,34.54 0 top
SCL_S4_C4_C2  113.28,34.35 0 top
SDA  62.59,49.36 0 top
SDA2  4.78,35.82 0 top
SDA_S2_C1  179.56,37.31 0 top
SDA_S2_C2_C2  171.28,37.28 0 top
SDA_S3_C1  179.71,15.64 0 top
SDA_S3_C1_C1  124.26,15.64 0 top
SDA_S3_C3_C3  171.33,15.67 0 top
SDA_S3_C3_C4  113.23,15.46 0 top
SDA_S4_C1  179.6,31.9 0 top
SDA_S4_C1_C1  124.29,32 0 top
SDA_S4_C4_C3  171.23,31.97 0 top
SDA_S4_C4_C4  113.31,31.79 0 top
U1  224.8,29.91 45 top
U2  207.22,27.83 270 bottom
U3  148.65,27.88 270 bottom
U4  87.48,27.57 270 bottom
U5  28.52,28.15 270 bottom
U$1  215.32,8.6 180 top
U$2  147.35,49.55 180 top
VCC  74.03,49.57 0 top
VCC2  4.49,53.03 0 top
VCC_1_C1  213.94,19.85 0 top
VCC_1_C2  139.59,19.85 0 top
VCC_1_C3  78.41,19.75 0 top
VCC_1_C4  19.5,20.14 0 top
VCC_2_C1  197.99,19.77 0 top
VCC_2_C2  155.51,35.74 0 top
VCC_2_C3  94.41,19.69 0 top
VCC_2_C4  35.53,20.08 0 top
VCC_3_C1  214.01,35.83 0 top
VCC_3_C2  139.56,35.76 0 top
VCC_3_C3  94.41,35.71 0 top
VCC_3_C4  35.5,36.14 0 top
VCC_4_C1  197.94,35.79 0 top
VCC_4_C2  155.51,19.8 0 top
VCC_4_C3  78.35,35.66 0 top
VCC_4_C4  19.5,36.12 0 top
VCC_C1  181.24,47.59 0 top
VCC_C2  173.26,47.59 0 top
VCC_C2_C3  121.6,49.7 0 top
VCC_C3  111.65,49.69 0 top
VDDA_C1  179.62,21.1 0 top
VDDA_C2  171.28,21.1 0 top
VDDD_C1  181.19,53.28 0 top
VDDD_C2  173.26,53.31 0 top
VDDIO_C1  179.73,13 0 top
VDDIO_C2  171.2,13.05 0 top

### Tracks (layer width: path | path; a pad name or v marks a point on that pad's centre or on a via)
3V3_C1  (via drill 0.5)
  Top 0.27: R8.1 210.34,26.96 v210.74,26.56 | v199.89,25.27 v201.97,25.27 | v200.32,30.66 183.79,30.66 v183.19,30.55 | 212.38,44.63 217.48,44.63 218.66,45.82 218.66,46.98 217.86,47.78 217.86,48.69 v217.84,48.71
  Top 0.28: CN1.VBUS 211.46,45.56 212.38,44.63 217.51,44.63 218.66,45.78 218.66,47.01 219.27,47.63 221.27,47.63 R14.1
  Top 0.305: 221.29,47.63 R14.1 | R6.1 R8.1
  Top 0.5: U$1.3 214.69,10.12 214.2,9.63 212.11,9.63 211.39,10.35 211.39,13.09 210.78,13.7 187.07,13.7 185.49,12.13 185.49,12.08 185.09,11.67 183.24,11.67 v183.19,11.66 | v183.19,42.74 179.47,42.68 3V3_C1.TP
  Bottom 0.27: v210.74,26.56 210.74,26.38 210.28,25.92 | 210.28,25.92 210.27,25.91 208.87,25.91 U2.7 | U2.1 205.72,30.58 205.02,31.28 200.95,31.28 | 200.95,31.28 200.94,31.28 199.92,30.25 199.92,25.56 v199.89,25.27 | v201.97,25.27 201.97,23.93 202.29,23.58 209.74,23.58 210.28,23.99 210.28,25.92 | 200.95,31.28 v200.32,30.66 | v217.84,48.71 189.36,48.74 v183.19,42.74
  Bottom 0.5: v183.19,11.66 v183.19,30.55 v183.19,42.74
3V3_C2  (via drill 0.6)
  Top 0.406: 161.2,44.54 R12.1 | 165.65,44.52 166.23,43.93
  Top 0.813: 171.25,42.69 3V3_C2.TP | L1.1 159.15,5.4 R15.1
  Top 1.016: v150.2,24.3 136.51,24.3 135.57,25.24 135.57,33.9 | 135.57,33.9 133.15,36.32 | 135.57,33.9 136.89,32.58 141.23,32.58 v142.75,31.06 | 3V3_C2_C3.TP 126.85,42.61 133.15,36.32 | 133.15,36.32 133.12,36.32 132.49,36.95 132.44,36.95 132.39,37 | 161.2,44.54 161.2,39.04 v161.73,38.52 | v159.12,34.15 158.95,33.96 156.54,31.51 v151.44,31.51
  Top 1.27: 165.62,44.55 166.23,43.93 167.47,42.69 v168.47,42.69 171.25,42.69 | LED5.A 162.59,51.42 L2.1 163.87,51.42 v163.86,51.41 | R10.1 161.2,44.54 | R12.1 165.65,44.52 | L1.1 159.15,8.87 157.56,10.47 v125.37,10.47
  Top 1.778: D2.C 133.36,51.82 v132.09,52.95 D3.C
  Top 2.54: v124.88,45.33 124.88,43.23 3V3_C2_C3.TP
  Bottom 0.406: U3.7 150.15,24.35 v150.2,24.3 | U3.1 147.15,30.42 146.46,31.11 142.81,31.11 v142.75,31.06
  Bottom 1.016: v161.73,38.52 161.73,36.76 v159.12,34.15 | v151.44,31.51 151.47,32.71 150.66,33.48 145.12,33.46 v142.75,31.06
  Bottom 1.27: v163.86,51.41 163.86,48.8 165.93,46.72 167.72,46.72 168.64,45.81 168.64,42.87 v168.47,42.69 | v125.37,10.47 125.37,44.84 v124.88,45.33
  Bottom 1.778: 125.37,44.84 125.37,48.01 130.25,52.89 133.27,52.89 v132.09,52.95
3V3_C3  (via drill 0.5, 0.6)
  Top 0.305: v88.98,20.47 v88.93,24.05
  Top 0.813: R26.2 R27.2 | R26.2 82.58,6.33 81.7,7.21 81.7,13.97 84.41,16.71 87.97,16.71 88.94,17.68 88.94,20.98 v88.98,20.47 | 3V3.TP 70.65,46.43 69.97,47.11 69.97,52.09 67.71,54.35 60.92,54.35 v60.85,54.42 | v87.74,3.8 87.74,6.11 R26.2
  Top 2.54: 3V3.TP 109.32,46.43 3V3_C3.TP
  Bottom 0.305: U4.1 85.98,30.34 85.29,31.03 81.53,31.03 80.66,30.12 80.7,23.09 81.98,21.8 87.73,21.76 v88.98,20.47 | v88.93,24.05 88.93,25.75 U4.7
  Bottom 0.813: v87.74,3.8 72.16,3.8 62.76,13.2 62.76,41.68 60.55,43.89 60.55,54.12 v60.85,54.42
3V3_C4  (via drill 0.5)
  Top 0.305: v2.85,24.84 2.85,26.48 R24.2
  Top 0.61: 2.86,26.6 R25.2 1.71,29.48 0.53,30.65 0.53,46.36 1.48,47.31 4.68,47.31
  Top 1.016: 2.86,26.6 R24.2 | 4.68,47.31 3V32.TP
  Bottom 0.305: U5.1 26.65,29.92 25.9,30.68 25.9,31.76 25.42,32.23 11.04,32.23 10.03,31.22 10.03,26.48 | 10.03,26.48 8.35,24.8 2.89,24.8 v2.85,24.84 | U5.7 30.02,24.14 28.64,22.76 13.74,22.76 10.03,26.48
CAN_RX
  Top 0.27: 216.29,15.82 216.21,15.79 216.9,16.48 229.16,16.51 230.45,17.79 230.45,26.04 230.39,26.1
  Top 0.28: U$1.4 213.42,13.69 214.05,14.32 214.8,14.32 216.29,15.82
  Top 0.305: U1.27 229.71,26.73 229.76,26.73 230.39,26.1 | 213.49,11.75 U$1.4
CAN_TX
  Top 0.27: U$1.1 217.23,14.59 218.44,15.79 218.46,15.79 218.6,15.94 229.51,15.94 231.12,17.55 231.12,26.06 230.74,26.44
  Top 0.305: U1.28 230.74,26.44 231.15,26.03
CANH  (via drill 0.5)
  Top 1: S1.1 192.27,8.06 v195.34,11.13 194.79,11.67 187.27,11.67 186.35,10.76 186.35,10.71 183.77,8.12 CANH_C1.TP
  Bottom 1: CANH_2_C1.TP 219.59,13.98 215.73,10.12 196.35,10.12 v195.34,11.13 CANH_1_C1.TP 192.34,14.78 187.78,19.33 187.78,36.87 CANH_4_C1.TP 196.63,45.72 215.44,45.72 219.65,41.51 CANH_3_C1.TP
CANH_C3  (via drill 0.5)
  Top 1.016: CANH_C3.TP 101.61,7.02 v97.34,11.29 | CANH.TP 62.59,41.68 v67.85,36.43
  Bottom 1.016: CANH_1_C3.TP | CANH_1_C3.TP 77.22,9.41 77.31,9.41 78.28,8.45 94.5,8.45 v97.34,11.29 CANH_2_C3.TP | CANH_3_C3.TP 100,41.37 94.57,46.8 78.21,46.8 CANH_4_C3.TP v67.85,36.43 66.54,35.12 66.54,20.1 CANH_1_C3.TP
CANH_C4  (via drill 0.5)
  Top 1.016: CANH2.TP 11,38.68 v11.46,39.14
  Bottom 1.016: CANH_1_C4.TP 13.85,14.34 19.01,9.18 35.9,9.18 CANH_3_C4.TP 46.61,19.89 46.61,36.55 41.41,41.75 CANH_4_C4.TP 35.74,47.14 19.5,47.14 14.07,41.71 CANH_2_C4.TP 11.46,39.33 v11.46,39.14
CANL  (via drill 0.5)
  Top 1: U$1.6 214.69,7.3 | R16.1 210.08,8.27 213.71,8.27 214.69,7.3 | 214.69,7.3 214.69,7.51 213.92,8.27 v207.13,8.27 | CANL_C1.TP 184.65,5 186.13,6.47 186.13,7.74 187.22,8.83 190.38,8.83 v191.38,9.83
  Bottom 1: CANL_3_C1.TP 222.48,44.36 219.55,47.29 192.46,47.29 CANL_4_C1.TP 186.05,40.89 186.05,14.41 186.81,13.65 186.81,13.6 189.12,11.29 CANL_1_C1.TP 189.92,11.29 v191.38,9.83 192.94,8.27 v207.13,8.27 219.35,8.27 CANL_2_C1.TP
CANL_C3  (via drill 0.5)
  Top 1.016: CANL_C3.TP 99.57,3.17 98.6,4.15 98.6,6.78 v98.51,6.87 | CANL.TP 62.56,44.83 v62.61,44.78
  Bottom 1.016: CANL_2_C3.TP 98.65,6.87 v98.51,6.87 74.25,6.87 69.97,11.15 CANL_1_C3.TP 69.9,11.24 64.55,16.59 64.55,38.73 | CANL_3_C3.TP 102.87,44.45 98.42,48.9 74.73,48.9 CANL_4_C3.TP 64.55,38.73 | 64.55,38.73 64.55,42.84 v62.61,44.78
CANL_C4  (via drill 0.5)
  Top 1.016: CANL2.TP 8.27,41.66 v9.09,42.47
  Bottom 1.016: CANL_1_C4.TP 11.22,11.65 15.94,6.93 39.34,6.93 CANL_3_C4.TP 48.52,16.12 48.52,39.9 43.96,44.47 CANL_4_C4.TP 44.2,44.34 44.2,44.12 39.21,49.11 15.67,49.11 11.18,44.63 CANL_2_C4.TP 9.09,42.66 v9.09,42.47
CMOD
  Top 0.25: C4.1 228.23,7.73 228.77,8.28 230.93,8.28 231.83,9.18 231.83,11.52 231.82,11.53
  Top 0.305: U1.29 231.78,26.1 231.82,11.53 | 227.84,7.07 R18.2
  Top 0.813: 227.84,7.07 C4.1
CTANK
  Top 0.305: U1.30 232.44,26.16 232.44,8.79 C5.1
DN_1
  Top 1.778: DINA.1 217.36,1.85 216.81,1.48 200.15,1.48 199.97,1.48 194.56,1.48 192.27,3.41 S1.2
GND3  (via drill 0.5)
  Top 0.35: v90.56,27.56 90.56,27.06 90.09,26.59 87.54,26.59 R7.1 | R21.2 81.92,26.6 80.7,25.37 80.7,15.88 v78.63,13.81
  Top 0.406: R21.2 83.72,26.62 R7.1
  Top 1.93: 111.73,52.56 GND_C3.TP
  Top 2.54: GND.TP v106.9,52.57 | v106.9,52.57 108.65,52.57 | 108.65,52.57 111.73,52.56 | v106.9,52.57 108.65,52.57
  Bottom 0.35: 87.5,27.52 90.52,27.52 v90.56,27.56 | v78.63,13.81 | v78.63,13.81 78.22,14.22
  Bottom 0.406: U4.12 87.28,27.75 87.5,27.52 89.2,27.52 U4.13
  Bottom 2.54: 80.29,43.02 92.75,43.02 | 107.1,52.43 v106.9,52.57
  Bottom 3.2: GND_2_C3.TP 97.27,16.76 92.47,11.96 80.48,11.96 v78.63,13.81 78.22,14.22 GND_1_C3.TP 70.57,22.05 70.66,33.28 75.62,38.25 GND_4_C3.TP 75.74,38.47 80.29,43.02 92.48,43.11 GND_3_C3.TP | 92.75,43.02 98.52,37.25 103.62,37.25 107.17,40.85 107.1,52.43
  pour Bottom (isolate 0.762): 58.81,0.16 114.29,0.1 113.95,10.34 115.93,10.38 116.03,45.2 114.47,45.31 114.13,55.21 58.67,55.41
GND4  (via drill 0.5, 0.6)
  Top 0.305: R22.2 28.42,27.23 R9.1 28.56,27.24 32.46,27.24 32.97,27.75 v32.97,28.05
  Top 1.016: 32.46,27.24 32.46,13.41 v33.47,12.39
  Top 2.184: C2.- 9.02,12.34 | 9.02,12.34 D1.A | 9.02,12.34 21.44,12.34 v21.48,12.3
  Top 2.54: 48.4,11.68 v48.54,11.93 | 46.69,2.96 BATTERY-.TP | 21.38,12.21 v21.48,12.3 | GND2.TP 9.37,50.08 11.01,48.45 46.42,48.45 48.32,46.55
  Top 3.2: BATTERY-.TP 35.9,2.98 33.28,5.6 33.28,12.2 v33.47,12.39 | 48.31,47.39 48.32,46.55 48.4,11.68 | v52.54,2.96 46.69,2.96
  Bottom 0.305: U5.12 28.24,28.33 28.52,28.05 30.19,28.05 | 30.19,28.05 U5.13 | 30.19,28.05 v32.97,28.05
  Bottom 2.54: 50.37,2.96 v52.54,2.96 | v21.48,12.3 24.44,12.3 24.7,12.03
  Bottom 3.2: GND_1_C4.TP 16.67,17.12 21.03,12.75 v21.48,12.3 21.75,12.03 24.7,12.03 33.11,12.03 v33.47,12.39 GND_2_C4.TP 38.42,17.28 43.76,22.62 43.76,33.52 GND_3_C4.TP 33.33,43.96 21.58,43.96 16.7,39.08 GND_4_C4.TP | v48.54,11.93 48.4,4.93 50.37,2.96
  pour Bottom (isolate 0.762): -0.03,0.8 54.91,0.64 55.03,55.35 -0.03,55.41 -0.03,7.88
GND_C1  (via drill 0.5)
  Top 0.25: U$1.2 | U1.10 220.02,24.09 219.58,24.09 v219.56,24.06 | v223.55,21.52 225.81,21.52 226.84,22.56 U1.17
  Top 0.27: R4.2 201.28,26.96 v200.95,26.95
  Top 0.28: v218.35,37.08 218.06,36.79 218.06,36.28 U1.57 220.57,33.77 218.09,36.24 | U1.49 223.42,40.92 224.26,41.76 225.28,41.76 C7.2 | CN1.D- 210.68,44.1 v210.28,43.7 | 224.21,34.59 224.21,35.85 223.29,36.77 223.29,37.15 223.41,37.27 v223.41,38.94 | C10.2 220.88,50.18 220.61,49.92 219.01,49.92 v218.97,49.96 | v225.05,50.06 225.05,50.43 225.68,51.06 226.96,51.06 C9.2
  Top 0.305: 225.71,5.09 R18.1 226.47,5.14 | R17.2 223.23,6.22 C6.2 | U1.17 226.15,23.23 224.21,25.17 224.21,34.59 224.24,34.61 224.24,35.78 U1.49 | U1.10 | CN1.D- 210.68,48.13 211.34,48.79 212.68,48.79 213.85,49.96 221.03,49.96 C10.2 | 228.4,5.09 C4.2 | R19.2 R4.2 | C9.2 C8.2 231.72,50.85 232.27,50.31 232.27,41.49 R13.1
  Top 0.5: v215.96,13.56
  Top 0.813: 228.4,5.09 C5.2 229.34,3.82 DINA.3 | C4.2 226.47,5.14 | R17.2 225.06,4.67 R18.1
  Top 1: C6.2 223.33,8.71 | 223.33,8.71 222.56,9.48 216.72,9.48 215.96,10.25 U$1.2 | U$1.2 v215.96,13.56 | 223.33,8.71 223.77,9.14 228.54,9.14 C1.-
  Top 2.54: v198.19,41.75 195.39,41.75 193.12,44.02 193.12,47.97 190.61,50.48 GND_C1.TP
  Bottom 0.25: v219.56,24.06 220.04,24.06 221.08,25.1 221.65,25.1 223.55,23.21 v223.55,21.52
  Bottom 0.27: U2.13 211.46,27.83 211.91,27.38 211.91,25.85 212.59,25.18 218.44,25.18 v219.56,24.06 218.5,22.92 201.68,22.92 200.95,23.64 v200.95,26.95
  Bottom 0.28: GND_3_C1.TP v218.35,37.08 220.21,38.94 v223.41,38.94 | v210.28,43.7 211.25,43.7 | 211.25,43.7 211.59,44.04 211.62,44.04 | 211.62,43.14 211.62,43.33 211.25,43.7 | v218.97,49.96 224.95,49.96 v225.05,50.06
  Bottom 0.305: U2.13 207.37,27.83 207.19,28.01 U2.12
  Bottom 0.5: v215.96,13.56 215.96,13.94 214.94,14.96
  Bottom 1.778: v198.19,41.75 198.35,41.75 199.73,43.14
  Bottom 3.1: GND_2_C1.TP 216.93,16.95 214.94,14.96 212.87,12.89 199.23,12.89 198.97,13.15 198.97,13.19 GND_1_C1.TP 191.03,20.93 191.03,34.72 195.11,38.6 GND_4_C1.TP v198.19,41.75 199.58,43.14 199.73,43.14 211.62,43.14 212.24,43.14 213.17,42.21 213.24,42.21 GND_3_C1.TP
  pour Top (isolate 0.762): 178.07,55.14 178.17,45.03 176.62,45.13 176.79,10.59 178.14,10.66 177.96,-0.08 233.15,0.1 233.15,55.09
  pour Bottom (isolate 0.762): 177.95,55.14 178.05,45.03 176.5,45.13 176.68,10.59 178.03,10.66 177.85,-0.08 233.04,0.1 233.04,55.09
GND_C2  (via drill 0.6)
  Top 0.305: v152.64,26.89 v152.63,26.88 R5.1 148.44,26.65 R20.2 148.49,26.65 148.75,26.92 152.76,26.92
  Top 0.406: 152.76,26.92 152.76,29.04 153.77,30.04 157.78,30.04 160.83,33.09 160.83,35.24 160.41,35.66 v158.58,35.66
  Top 1.016: 155.13,45.14 U$2.IN-
  Top 1.93: 155.13,45.14 155.13,47.96 155.87,48.69 R23.2 166.95,48.69 168.75,50.49 173.19,50.49 GND_C2.TP
  Top 2.54: GND_C2_C3.TP 128.41,52.62 136.03,45.01 139.71,45.01 U$2.OUT-
  Bottom 0.305: U3.12 148.12,28.06 148.44,27.73 150.27,27.73 U3.13 150.45,27.91 151.93,27.91 152.64,27.2 v152.64,26.89
  Bottom 0.406: v158.58,35.66 158.58,38.42 158.07,38.92
  Bottom 3: GND_4_C2.TP 158.35,16.96 153.76,12.08 141.09,12.08 GND_2_C2.TP 131.72,22.25 131.72,33.14 132.75,34.68 132.81,34.68 GND_3_C2.TP 140.78,42.63 | GND_1_C2.TP 158.07,38.92 154.06,42.94 | 154.06,42.94 141.09,42.94 140.78,42.63 | U$2.OUT- 139.73,43.67 140.78,42.63 | U$2.IN- 154.97,43.86 154.06,42.94
  pour Bottom (isolate 0.813): 119.54,0.6 174.86,0.24 174.95,10.45 173.14,10.42 173.23,45.9 175.04,45.79 174.95,55.55 119.47,55.52 119.68,46.12 121.18,45.88 121.08,9.99 119.44,9.91
LED_S1  (via drill 0.6)
  Top 0.305: v203.21,25.19 216.89,25.19 U1.4
  Bottom 0.305: LED1.A v203.21,25.19
LED_S2
  Top 0.305: U1.5 216.76,24.35 186.52,24.35 184.36,26.51 184.36,28.7 183.83,29.23 L_C2.TP
LED_S2_C2  (via drill 0.6)
  Top 0.305: v165.08,29.13 171.15,29.13 L_C2_C1.TP
  Bottom 0.305: LED2.A 144.76,23.9 145.7,22.96 163.96,22.96 165.01,24 165.01,29.05 v165.08,29.13
LED_S3
  Top 0.305: U1.6 216.73,23.62 189.29,23.66 189.26,23.64 185.86,23.62 182.94,26.56 L_C3.TP
LED_S3_C3  (via drill 0.6)
  Top 0.406: v106.79,26.37 113.26,26.38 L_C2_C3.TP
  Bottom 0.406: LED3.A 83.62,23.52 84.63,22.51 105.88,22.48 105.87,22.43 106.8,23.33 v106.79,26.37
LED_S4
  Top 0.305: U1.7 216.65,22.83 188.63,22.83 188.6,22.8 185.52,22.83 184.48,23.87 L_C4.TP
LED_S4_C4  (via drill 0.5)
  Top 0.305: v13.14,29.54 13.14,35.56 v13.4,35.82 | v8.04,44.63 4.97,44.63 LEDC.TP
  Bottom 0.305: LED4.A 24.99,25.26 24.45,24.72 15.1,24.72 13.14,26.6 v13.14,29.54 | v13.4,35.82 13.4,36.68 13.01,37.08 6.15,37.08 4.89,38.34 4.89,43.73 5.75,44.59 8,44.59 v8.04,44.63
LED_T_S4
  Top 1.016: LED.TP 95.83,43.2 100.77,38.26 100.77,26.11 103.03,23.85 113.09,23.85 L_C2_C4.TP
MOTOR  (via drill 0.5)
  Top 0.25: U1.9 220.9,25.71 220.56,26.04 220.56,26.01 216.68,22.12 v184.66,22.12
  Top 0.305: U1.9 U1.8
  Top 0.406: S1.3 204.12,3.98 v204.18,3.92
  Bottom 0.25: v184.66,22.12 184.66,10.67 188.87,6.46 202.91,6.46 204.17,5.2 204.17,4.64 v204.18,3.92
N$1
  Top 0.305: CN1.D+ 209.86,49.8 210.85,50.79 216.11,50.79 218.27,52.95 222.43,52.95 R1.1
N$2
  Top 0.305: R2.1 199.98,44.16 200.84,43.3 208.24,43.3 209.02,44.09 209.02,46.72 CN1.ID
N$3
  Top 0.305: CN1.GND 208.26,44.55 207.7,43.99 203.51,43.99 202.67,44.82 202.67,47.2 R3.1
N$4
  Top 0.305: R13.2 230.1,40.03 230.84,39.29 231.35,39.29 231.99,38.65 231.99,37.57 R11.2
N$5
  Top 0.406: 216.01,5.58 U$1.7
  Top 1: S1.4 209.93,6.52 R16.2 211.07,6.4 211.88,5.59 211.88,4.11 212.69,3.3 215.33,3.3 216,3.97 216,5.49 U$1.7
N$6  (via drill 2)
  other vias: 205.98,35.84
N$7  (via drill 0.6)
  Top 1.27: CANH_C2_C3.TP 125.46,7.16 127.59,5.03 127.59,5.02 129.34,3.36 166.69,3.36 167.78,4.45 167.78,6.88 168.73,7.82 170.06,7.82 170.31,8.07 | v170.92,9.28 169.71,8.07 170.31,8.07 | CANH_C2.TP 170.31,8.07
  Bottom 1.016: CANH_4_C2.TP 133.86,40.89 | 133.86,40.89 133.86,39.89 129.11,35.19 129.11,18.91 CANH_1_C2.TP 138.04,9.52 156.03,9.52 160.01,14.16 CANH_3_C2.TP | CANH_2_C2.TP 159.67,41.49 158.14,43.01 158.14,46.89 156.46,48.57 138,48.57 135.73,46.3 135.73,42.76 133.86,40.89
  Bottom 1.27: v170.92,9.28 170.92,22.07 169.58,23.41 166.79,23.41 164.66,21.27 164.66,17.54 CANH_3_C2.TP
N$8  (via drill 0.6)
  Top 0.406: R7.2 87.5,31.03 v86.72,31.81
  Bottom 0.406: U4.3 U4.2 v86.72,31.81
N$9
  Top 0.813: R17.1 219.03,4.69 218.17,5.53 U$1.8
N$10
  Top 0.406: SDA_S3_C1_C1.TP 129.29,15.64 132.7,12.24 162.16,12.24 165.56,15.64 171.31,15.64 SDA_S3_C3_C3.TP
N$11  (via drill 0.6)
  other vias: 212.05,49.8
N$12  (via drill 0.6)
  other vias: 207.65,49.8
N$13  (via drill 1.5)
  other vias: 60.6,30.35
N$14  (via drill 0.6)
  Top 0.305: R19.1 201.34,28.86 v201.2,28.85
  Bottom 0.305: v201.2,28.85 203.15,28.85 LED1.C
N$15  (via drill 0.6)
  Top 0.813: v142.83,28.62 144.67,28.64 R20.1
  Bottom 0.813: LED2.C 142.97,28.65 v142.83,28.62
N$16  (via drill 0.6)
  Top 0.406: R21.1 81.7,28.5 v81.66,28.49
  Bottom 0.406: v81.66,28.49 83.38,28.49 LED3.C
N$17  (via drill 0.6)
  Top 0.305: R22.1 22.85,29.13 v22.83,29.14
  Bottom 0.305: v22.83,29.14 24.91,29.14 LED4.C
N$18
  Top 1.016: LED5.C 159.38,50.68 R23.1
N$19  (via drill 1.5)
  other vias: 60.6,22.61
N$20
  Top 0.406: L_C1_C4.TP 128.07,23.87 128.96,22.98 128.96,20.16 134.2,14.93 160.59,14.93 165.44,19.78 165.44,23.06 166.28,23.9 171.18,23.9 L_C4_C1.TP
N$21  (via drill 0.6)
  Top 0.305: v205.09,32.58 205.09,28.91 R4.1
  Bottom 0.305: U2.2 206.47,31.71 205.62,32.56 205.11,32.56 v205.09,32.58
  Bottom 0.406: U2.2 U2.3
N$22
  Top 0.406: L_C1_C3.TP 128.71,26.64 130.08,25.27 130.08,21.2 135.06,16.22 159.93,16.22 164.07,20.36 164.07,25.22 165.36,26.51 171.05,26.51 L_C3_C2.TP
N$23  (via drill 2 pad 2.18)
  other vias: 213.98,27.86
N$24
  Top 2.54: D2.A 137.06,51.82 D3.A 137.12,54.13 U$2.OUT+
N$25  (via drill 2 pad 2.18)
  other vias: 197.97,27.86
N$26
  Top 0.406: SCL_S3_C1_C3.TP 128.53,18.43 133.48,13.48 161.45,13.48 166.35,18.38 171.23,18.38 SCL_S3_C3_C1.TP
N$27
  Top 0.406: SCL_S4_C1_C4.TP 130.72,34.54 132.95,32.3 132.95,24.38 134.32,23.01 159.62,23.01 160.84,24.23 160.84,30.19 165.23,34.59 171.15,34.59 SCL_S4_C4_C1.TP
N$28  (via drill 2 pad 2.18)
  other vias: 205.95,19.86
N$29  (via drill 2)
  other vias: 2.74,20.65
N$30  (via drill 2 pad 2.18)
  other vias: 139.53,27.86
N$31  (via drill 2 pad 2.18)
  other vias: 147.48,35.83
N$32  (via drill 0.6)
  Top 1.27: CANL_C2_C3.TP 125.88,3.24 127.73,1.39 168.51,1.39 170.31,3.18 170.31,3.2 | CANL_C2.TP 173.12,5.19 171.36,5.19 170.31,4.14 170.31,3.2 | 170.31,3.2 168.58,1.47 156.46,1.47 v156.25,1.25
  Bottom 1.016: CANL_2_C2.TP 161.42,44.34 160.62,45.13 160.62,47.04 157.41,50.25 137.07,50.25 CANL_3_C2.TP 131.06,40.08 127.33,36.72 127.33,14.76 CANL_1_C2.TP 131.39,11.3 135,7.69 154.49,7.69 160.47,7.69 CANL_4_C2.TP
  Bottom 1.27: v156.25,1.25 156.25,5.94 154.49,7.69
N$33  (via drill 2 pad 2.18)
  other vias: 155.53,27.86
N$34  (via drill 2 pad 2.18)
  other vias: 147.53,19.86
N$35  (via drill 2)
  other vias: 78.41,27.67
N$36  (via drill 2)
  other vias: 86.41,35.7
N$37  (via drill 2)
  other vias: 94.41,27.67
N$38  (via drill 2)
  other vias: 86.41,19.67
N$39  (via drill 2)
  other vias: 19.56,28.2
N$40  (via drill 2)
  other vias: 27.56,36.2
N$41  (via drill 2)
  other vias: 35.56,28.2
N$42  (via drill 2)
  other vias: 27.56,20.18
N$43  (via drill 0.6)
  Top 0.305: R5.2 148.67,30.83 147.94,31.57 v147.9,32.05
  Bottom 0.305: v147.9,32.05 147.94,29.72 U3.2 U3.3
N$44
  Top 0.406: SDA_S4_C1_C1.TP 129.83,32 131.38,30.45 131.38,22.45 136.48,17.34 159.14,17.34 162.82,21.02 162.82,29.56 165.23,31.97 SDA_S4_C4_C3.TP
N$45  (via drill 2)
  other vias: 10.94,20.71
N$46  (via drill 0.6)
  Top 0.305: R9.2 28.5,31 v27.79,31.71
  Bottom 0.305: U5.3 U5.2 v27.79,31.71
P0_1
  Top 0.305: U1.40 229.98,34.74 229.98,37.39 R11.1
P0_4
  Top 0.305: U1.43 227.96,34.83 228.78,35.71 228.78,46.39 CRYSTAL.2 229.88,46.53 230.23,46.88 C8.1
P0_5
  Top 0.305: U1.44 227.6,35.18 228.05,35.63 228.05,44.29 227.03,45.41 227.03,46.51 CRYSTAL.1 227.02,48.82 C9.1
SAR_BY  (via drill 0.6)
  Top 0.305: v221.5,7.84 221.27,7.69 221.27,7.31 221.31,6.34 C6.1 | 217.05,29.91 v217.2,29.94 217.08,29.94 217.61,29.94 218.07,29.48 218.07,28.67 | 218.07,28.54 218.07,28.67 | U1.1 218.12,28.63 218.07,28.67
  Bottom 0.28: 224.61,28.06 224.61,16.58 224.6,16.56 224.6,15.54 225.24,14.76 225.24,8.76 224.32,7.84 v221.5,7.84
  Bottom 0.305: v217.2,29.94 222.72,29.95 224.61,28.06
SCL_S1  (via drill 0.6)
  Top 0.305: U1.2 218.47,28.16 217.76,27.45 216.34,27.45 216.06,27.73 216.06,29.1 215.58,29.58 v210.73,29.58 210,28.86 R8.2
  Bottom 0.305: v210.73,29.58 U2.5
SCL_S2
  Top 0.305: SCL_S2_C2.TP 192.44,40
  Top 0.32: 192.44,40 218.6,40 U1.51
SCL_S2_U  (via drill 0.6)
  Top 0.305: v165.54,40.02 171.2,40.02 SCL_S2_C2_C1.TP
  Top 0.406: v153.16,34.67 153.57,34.92 154.99,36.33 154.99,41.56 157.42,44 157.42,45.62 158.23,46.43 159.13,46.43 R10.2
  Bottom 0.305: U3.5 152.45,29.66 153.42,30.63 153.42,31.9 153.42,32.25 154.01,32.84 163.99,32.84 165.54,34.39 v165.54,40.02
  Bottom 0.406: v153.16,34.67 153.43,34.34 153.42,31.9
SCL_S3
  Top 0.305: SCL_S3_C3.TP 194.47,18.33 196.05,16.76 214.12,16.76 U1.12
SCL_S3_U  (via drill 0.5)
  Top 0.813: R27.1 84.24,13.16 86.14,15.06 103.9,15.06 106.91,18.08 | 106.91,18.08 107,18.17 113.18,18.17 SCL_S3_C3_C2.TP | v100.19,23.95 101.04,23.95 106.91,18.08
  Bottom 0.813: U4.5 91.28,29.35 92.04,28.58 92.04,24.87 93.02,23.89 100.13,23.89 v100.19,23.95
SCL_S4
  Top 0.305: SCL_S4_C4.TP 189.36,34.56
  Top 0.32: 189.36,34.56 198.86,34.56 202.69,38.39 207.62,38.39 210.97,35.05 218.6,35.05 U1.58
SCL_S4_U  (via drill 0.5)
  Top 1.016: SCL.TP 66.59,52.4 68.22,50.91 68.22,42.79 69.9,41.19 94.34,41.11 98.94,36.48 98.92,30.26 v98.76,30.21 | v103.4,30.29 103.4,32.05 105.73,34.38 113.26,34.38 SCL_S4_C4_C2.TP
  Bottom 1.016: v98.76,30.21 103.32,30.21 v103.4,30.29
SCL_S4_U_1  (via drill 0.5)
  Top 1.016: R25.1 v4.76,31.11 4.76,32.83 SCL2.TP
  Bottom 0.305: U5.5 30.02,33.59 29.66,33.95 5.88,33.95 SCL2.TP 4.93,31.27 v4.76,31.11
SDA_S1  (via drill 0.6)
  Top 0.305: U1.3 218.77,27.83 217.3,26.33 v216.09,26.33 | R6.2 206.96,31.96 v207.52,32.56
  Bottom 0.305: 208.36,31.34 207.93,30.91 207.93,29.64 U2.4 | v216.09,26.33 216.09,30.14 214.89,31.34 208.36,31.34 | v207.52,32.56 207.71,32.58 207.85,32.37 207.83,31.87 208.36,31.34
SDA_S2
  Top 0.305: SDA_S2_C1.TP 190.84,37.31
  Top 0.32: 190.84,37.31 200.17,37.31 202.06,39.2 218.7,39.2 U1.52
SDA_S2_U  (via drill 0.6)
  Top 0.305: 149.45,31.99 v149.46,31.95
  Top 0.406: 156.4,39.39 156.4,39.06 | 156.37,35.58 156.37,35.48 154.01,33.17 154.01,33.14 150.38,33.14 149.45,32.25 149.45,31.99 | 156.37,35.58 156.37,39.36 156.4,39.39 | SDA_S2_C2_C2.TP 158.07,37.28 156.37,35.58 | 156.4,39.39 156.4,41.58 R12.2
  Bottom 0.305: v149.46,31.95 149.44,29.69 U3.4
SDA_S3
  Top 0.305: SDA_S3_C1.TP 195.74,15.64 196.05,15.94 214.01,15.94 U1.13
SDA_S3_U  (via drill 0.5)
  Top 0.35: v92.04,31.38 92.04,24.99 93.32,23.71 98.3,23.71 v103.29,18.72
  Top 0.813: R26.1 87.96,12.14 89.12,13.3 105.18,13.3 v107.03,15.15 107.31,15.43 113.2,15.43 SDA_S3_C3_C4.TP
  Bottom 0.35: U4.4 88.23,30.61 89.12,31.51 91.92,31.51 v92.04,31.38 | v103.29,18.72 103.47,18.72 v107.03,15.15
SDA_S4
  Top 0.305: SDA_S4_C1.TP 184.18,31.9 185.83,33.55 189.67,33.55
  Top 0.32: 189.67,33.55 201.81,33.55 202.01,33.75 219.2,33.75 U1.59
SDA_S4_U  (via drill 0.5)
  Top 1.016: SDA.TP 65.38,49.36 66.76,48.06 66.76,41.47 69.02,39.21 92.59,39.21 97.05,34.75 97.05,29.7 v97.05,28.05 | v103.4,28.09 107.12,28.09 108.58,29.56 108.58,30.95 109.53,31.9 113.42,31.9 | 114.28,31.9 113.42,31.9 | 113.42,31.9 SDA_S4_C4_C4.TP
  Bottom 1.016: v97.05,28.05 v103.4,28.09
SDA_S4_U_1  (via drill 0.5)
  Top 1.016: R24.1 7.99,26.55 9.09,27.64 v9.09,32.62 9.09,35.18 8.53,35.73 4.86,35.73 SDA2.TP
  Bottom 0.305: U5.4 29.27,32.64 28.79,33.12 9.59,33.12 v9.09,32.62
SWDCLK  (via drill 0.6)
  Top 0.305: R2.2 199.98,50.97 v199.96,51.43 | v226.17,17.77 228.33,17.77 228.99,18.43 228.99,23.25 U1.21
  Bottom 0.305: v199.96,51.43 200.03,51.35 226.96,51.35 228.4,49.9 228.4,23.16 226.63,21.38 226.58,21.38 226.25,21.05 226.25,17.85 v226.17,17.77
SWDIO  (via drill 0.6)
  Top 0.305: R3.2 202.65,52.83 v202.75,52.93 | U1.20 228.35,23.18 228.35,20.44 227.87,19.96 v227.59,19.96
  Bottom 0.305: v202.75,52.93 227.67,52.93 229.65,50.95 229.67,21.94 v227.59,19.96
VCC_C2  (via drill 0.6)
  Top 2.54: VCC_C2.TP 170.76,47.59 v170.75,47.6 | U$2.IN+ 152.94,54.13 151.49,52.67 151.49,39.78 | 151.49,39.78 151.49,39.4 v151.64,39.25 | VCC_C2_C3.TP 125.97,49.7 136.53,39.32 150.72,39.32 151.49,39.78
  Bottom 2.54: v170.75,47.6 170.75,51.09 167.62,54.15 155.34,54.12 U$2.IN+
  Bottom 3: VCC_4_C2.TP 155.51,19.74 152.67,16.9 151.57,15.81 143.63,15.81 VCC_1_C2.TP 135.81,23.63 135.81,31.97 139.56,35.72 VCC_3_C2.TP 143.59,39.25 v151.64,39.25 151.79,39.25 153.11,38.23 153.3,37.99 155.51,35.79 VCC_2_C2.TP
  pour Top (isolate 0.813): 119.59,0.62 174.92,0.51 175.1,10.45 172.89,10.42 173.33,45.75 175.01,45.62 175.1,55.56 119.5,55.49 119.75,46.05 121.14,45.97 121.49,9.85 119.41,9.99
VCC_C3  (via drill 0.5)
  Top 1.93: 111.36,49.61 VCC_C3.TP
  Top 2.54: VCC.TP v111.21,49.61 | v111.21,49.61 111.36,49.61 | v111.21,49.61 109.08,49.61 109.07,49.61
  Bottom 2.54: 111.3,49.52 v111.21,49.61
  Bottom 3.2: VCC_2_C3.TP 94.41,19.61 92.2,17.4 91.06,16.1 90.19,16.1 82.35,16.08 VCC_1_C3.TP 78.41,19.81 76.26,21.96 76.26,21.97 74.6,23.63 74.69,31.99 VCC_4_C3.TP 78.35,35.74 81.87,39.25 90.69,39.25 | 90.69,39.25 90.88,39.25 VCC_3_C3.TP | 90.69,39.25 96.95,33.08 108.33,33.08 111.3,36.06 111.3,49.52
  pour Top (isolate 0.813): 58.94,0.28 114.23,0.05 113.99,10.26 115.88,10.37 116.1,45.1 114.51,45.17 114.26,55.2 58.67,55.31
VCC_C4  (via drill 0.5, 0.6)
  Top 2.184: 2.78,13 2.7,5.28 5.13,2.85 22.42,2.85 25.43,5.86 25.43,14.58 23.02,16.98 22.56,16.98 v22.23,17.31
  Top 2.54: 48.89,53.11 48.97,53.03 | 48.97,53.03 52.43,49.57 | 46.22,7.04 46.14,7.11 | C2.+ 2.7,13.8 D1.C 2.78,13 | VCC2.TP 48.97,53.03
  Top 3.2: BATTERY+.TP 46.14,7.11 39.5,7.11 38,8.61 38,22.55 v38.08,22.64 | 52.43,49.57 52.43,9.5 49.97,7.04 46.22,7.04
  Bottom 2.54: v22.23,17.31 22.69,17.31 23.74,16.26
  Bottom 3.2: VCC_1_C4.TP 19.5,20.04 v22.23,17.31 22.57,16.97 22.57,16.92 23.23,16.26 23.74,16.26 31.7,16.26 VCC_2_C4.TP v38.08,22.64 39.69,24.82 39.69,31.68 38.28,33.42 38.28,33.48 35.62,36.14 VCC_3_C4.TP 31.69,39.95 23.12,39.95 22.29,39.13 19.5,36.34 VCC_4_C4.TP
  pour Top (isolate 0.762): -0.03,0.81 55,0.43 55.04,55.26 0.09,55.33 -0.03,7.78
VCCC  (via drill 0.5)
  Top 1: C1.+ 227.12,13.05 226.8,12.73
  Top 1.778: 227.12,13.05 225.84,14.37 v223,14.37 | v226.8,11.12 226.8,12.73 | 183.32,47.59 v183.69,47.22
  Top 2.54: VCC_C1.TP 183.32,47.59
  Bottom 1: 214.05,19.96 VCC_1_C1.TP | v226.8,11.11 v226.8,11.12
  Bottom 1.778: v223,14.37 222.99,17.19 219.62,19.96 214.05,19.96 | DINA.2 226.8,3.8 | 226.8,3.8 v226.8,11.11 | v183.69,47.22 183.69,46.18 181.81,44.29 181.81,44.23 180.16,42.59 180.16,11.95 181.75,10.37 181.75,4.52 183.94,2.33 184,2.33 184.78,1.43 207.57,1.43 210.63,4.41 210.69,4.41 211.42,5.14 225.46,5.14 226.8,3.8
  Bottom 3: 201.01,39.04 210.79,39.04 | 201.36,16.6 210.31,16.6 | 194.7,22.86 194.7,32.73
  Bottom 3.1: VCC_4_C1.TP 197.94,35.97 | 197.94,35.97 201.01,39.04 | 210.79,39.04 VCC_3_C1.TP | 201.36,16.6 200.71,16.95 200.71,17.03 197.99,19.74 VCC_2_C1.TP 197.72,19.77 195,22.49 195,22.55 194.7,22.86 | 210.31,16.6 VCC_1_C1.TP | 194.7,32.73 197.94,35.97
  pour Top (isolate 0.762): 178.07,55.14 178.17,45.03 176.62,45.13 176.79,10.59 178.14,10.66 177.96,-0.08 233.15,0.1 233.15,55.09
VCCD
  Top 0.305: U1.48 226.06,36.6 225.38,37.28 225.38,39.81 C7.1
VDDA
  Top 0.305: VDDA_C1.TP 192.97,21.1 196.5,17.57 214.22,17.57 U1.11 221.65,25.02 221.7,25.02 223.12,26.44 223.12,31.94 U1.56
VDDA2  (via drill 0.6)
  Top 0.813: VDDA_C2.TP v167.32,21.1 | v163.51,8.45 161.13,8.45 L1.2
  Bottom 0.813: v167.32,21.1 167.32,10.18 165.59,8.45 v163.51,8.45
VDDD
  Top 0.305: VDDD_C1.TP 181.26,53.21 195.79,53.21 197.65,51.35 197.65,44.85 200.06,42.44 216.87,42.44 U1.50
VDDD2
  Top 0.813: VDDD_C2.TP
  Top 1.27: L2.2 VDDD_C2.TP
VDDIO
  Top 0.27: 214.45,15.13 214.62,15.13 216.38,16.89 216.42,16.89 216.54,17.02 228.64,17.02 229.86,18.24 229.86,25.92 229.8,25.98
  Top 0.28: 186.32,14.73 196.13,14.73 196.54,15.13 214.45,15.13
  Top 0.305: U1.26 229.8,25.98 | VDDIO_C1.TP 179.46,13.07 184.66,13.07 186.32,14.73
VDDIO2
  Top 0.813: R15.2 165.3,5.49 165.91,6.07 165.87,11.91 167.06,13 171.15,13 VDDIO_C2.TP
XRES
  Top 0.305: U1.47 227.24,36.95 227.24,44.16 226.6,44.8 223.99,44.8 223.2,45.59 223.2,47.63 R14.2 C10.1 223.21,49.65 R1.2

### Text on the board
bNames: EMERGE FACE 4 | EMERGE FACE 3 | EMERGE FACE 2 | EMERGE FACE 1